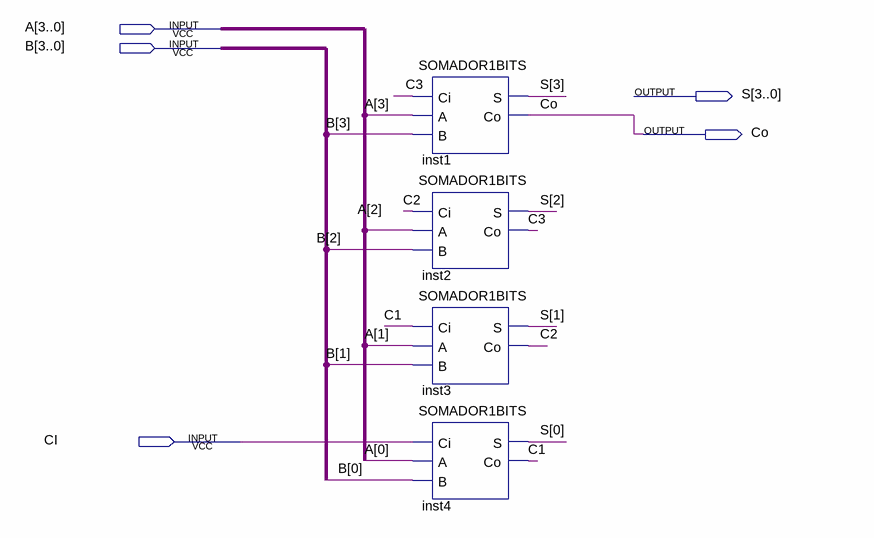
[diagram p0: schematic sheet]
// Quartus schematic SOMADOR4BITS.bdf as structural Verilog: 4 symbols, 5 pins
module SOMADOR4BITS (
  input  [3:0] A,
  input  [3:0] B,
  input  CI,
  output [3:0] S,
  output Co
);

  wire C1, C2, C3;

  SOMADOR1BITS inst1 (.Ci(C3), .A(A[3]), .B(B[3]), .S(S[3]), .Co(Co));
  SOMADOR1BITS inst2 (.Ci(C2), .A(A[2]), .B(B[2]), .S(S[2]), .Co(C3));
  SOMADOR1BITS inst3 (.Ci(C1), .A(A[1]), .B(B[1]), .S(S[1]), .Co(C2));
  SOMADOR1BITS inst4 (.Ci(CI), .A(A[0]), .B(B[0]), .S(S[0]), .Co(C1));
endmodule
